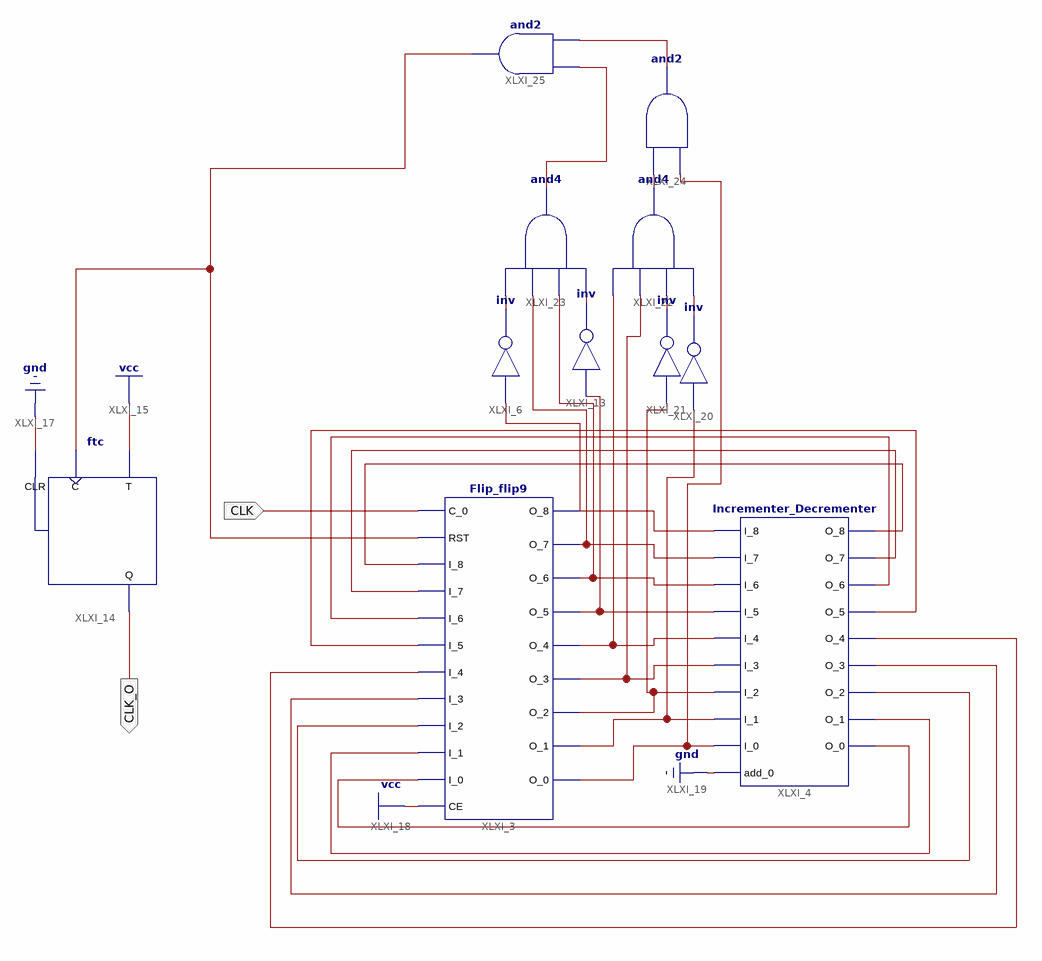
[diagram p0: schematic sheet 1]
// Xilinx ISE schematic Precale_434.sch (spartan3e) as structural Verilog: 11 symbols, 2 ports
module Precale_434 (
  input  CLK,
  output CLK_O
);

  wire RST, TICK0, TICK1, TICK2, TICK3, TICK4, TICK5, TICK6, TICK7, TICK8, XLXN_2, XLXN_4, XLXN_6, XLXN_8,
       XLXN_10, XLXN_11, XLXN_12, XLXN_13, XLXN_14, XLXN_39, XLXN_42, XLXN_57, XLXN_58, XLXN_135, XLXN_136,
       XLXN_137;

  Flip_flip9 XLXI_3 (
    .C_0(CLK), .RST(RST), .I_8(XLXN_13), .I_7(XLXN_12), .I_6(XLXN_14), .I_5(XLXN_11), .I_4(XLXN_10),
    .I_3(XLXN_8), .I_2(XLXN_6), .I_0(XLXN_2), .I_1(XLXN_4), .O_8(TICK8), .O_7(TICK7), .O_6(TICK6),
    .O_5(TICK5), .O_4(TICK4), .O_3(TICK3), .O_2(TICK2), .O_1(TICK1), .O_0(TICK0), .CE(1'b1));
  Incrementer_Decrementer XLXI_4 (
    .add_0(1'b0), .I_7(TICK7), .I_6(TICK6), .I_5(TICK5), .I_4(TICK4), .I_3(TICK3), .I_2(TICK2), .I_1(TICK1),
    .I_0(TICK0), .I_8(TICK8), .O_7(XLXN_12), .O_6(XLXN_14), .O_5(XLXN_11), .O_4(XLXN_10), .O_3(XLXN_8),
    .O_2(XLXN_6), .O_1(XLXN_4), .O_0(XLXN_2), .O_8(XLXN_13));
  not XLXI_6 (XLXN_39, TICK8);
  not XLXI_13 (XLXN_42, TICK5);
  ftc XLXI_14 (.C(RST), .CLR(1'b0), .T(1'b1), .Q(CLK_O));
  not XLXI_20 (XLXN_58, TICK1);
  not XLXI_21 (XLXN_57, TICK2);
  and XLXI_23 (XLXN_137, XLXN_42, TICK6, TICK7, XLXN_39);
  and XLXI_22 (XLXN_135, XLXN_58, XLXN_57, TICK3, TICK4);
  and XLXI_24 (XLXN_136, TICK0, XLXN_135);
  and XLXI_25 (RST, XLXN_136, XLXN_137);
endmodule
